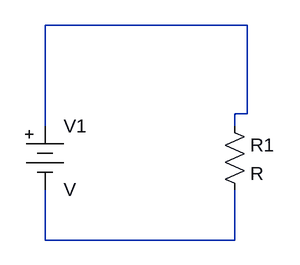
[diagram p0: schematic hello-world.asc]
hello-world.asc, the LTspice schematic file:
Version 4
SHEET 1 880 680
WIRE 112 48 -144 48
WIRE 112 160 112 48
WIRE 112 160 96 160
WIRE -144 176 -144 48
WIRE 96 176 96 160
WIRE -144 320 -144 256
WIRE 96 320 96 256
WIRE 96 320 -144 320
SYMBOL Misc/battery -144 160 R0
SYMATTR InstName V1
SYMBOL res 80 160 R0
SYMATTR InstName R1

The netlist it stands for:
* hello-world.asc
V1 N001 N002 V
R1 N001 N002 R
.backanno
.end